# Altium project QuadCape_4Layer.PrjPcb
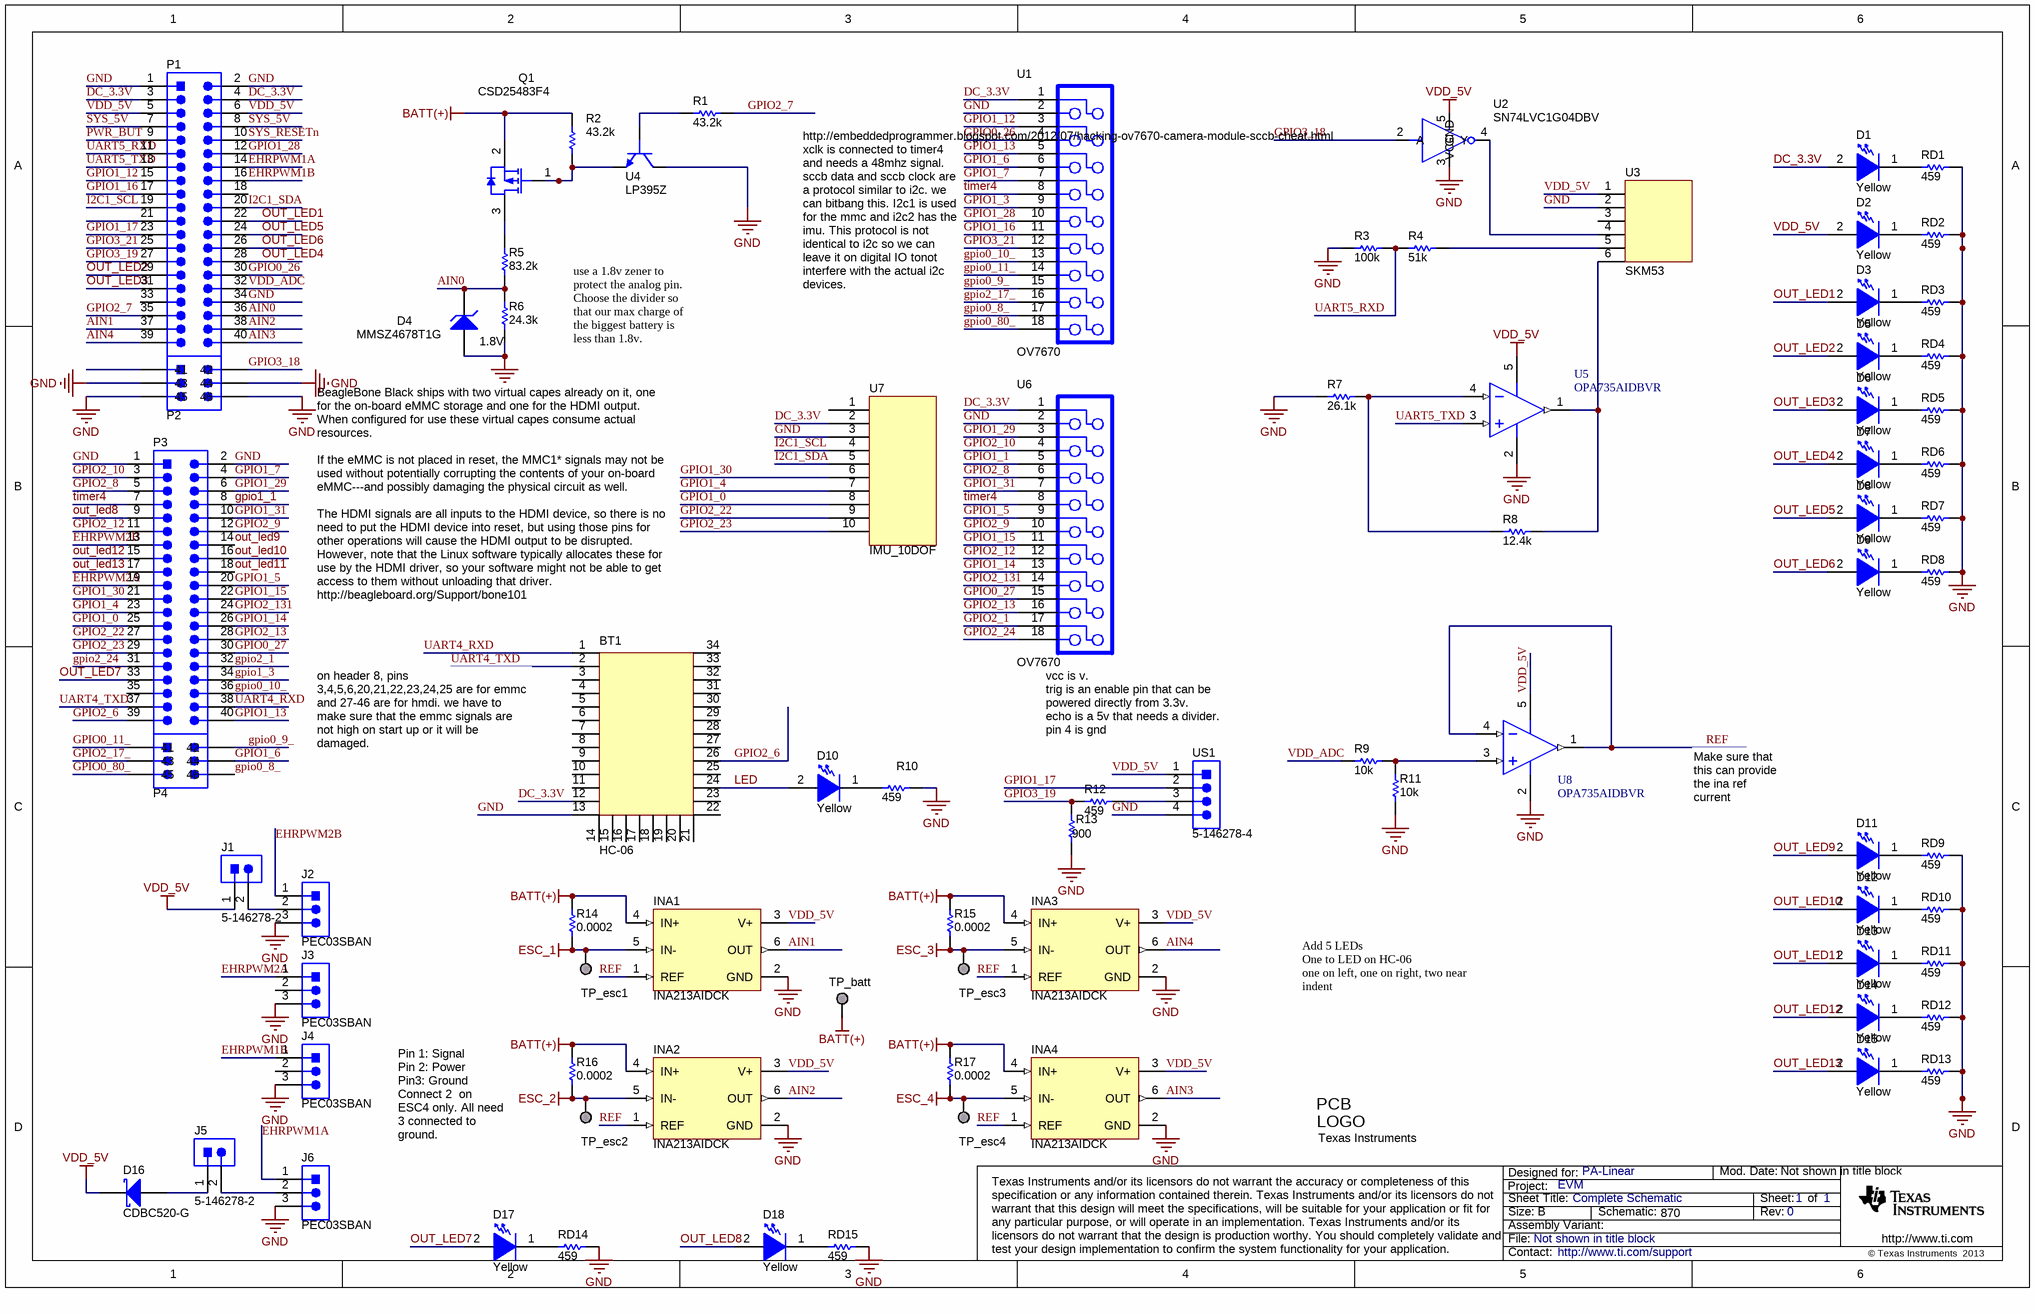
[diagram p0: QuadCape_4L_SCH.SchDoc]
CopyrightYear: 2013; PRJ_Customer: PA-Linear; PRJ_Title: EVM; SCH_Rev: 0; TechSupport: http://www.ti.com/support
1 sheet, 81 parts. Net scope: global (net labels, ports and power ports of the same name join across sheets).
Board file: QuadCape_4L_PCB.PcbDoc

## Sheet QuadCape_4L_SCH.SchDoc: Complete Schematic
size B; Date: Not shown in title block; ApprovedBy: Not shown in title block; CheckedBy: Not shown in title block; Author: Not shown in title block; CompanyName: Not shown in title block; DrawnBy: Not shown in title block; Engineer: Not shown in title block; Organization: Not shown in title block; Address1: Not shown in title block; Address2: Not shown in title block; Address3: Not shown in title block; Address4: Not shown in title block; DocumentNumber: 1; Revision: Use project parameter SCH_Rev; SheetNumber: 1; SheetTotal: 1; PageSetup: Record=PageOptions|CenterHorizontal=True|CenterVertical=True|PrintScale=0.72|XCorrection=1.00|YCorrection=1.00|PrintKind=0|BorderSize=5000000|LeftOffset=0|BottomOffset=0|Orientation=2|PaperLength=1000|PaperWidth=1000|Scale=100|PaperSource=15|PrintQuality=600|MediaType=1|DitherType=10|PaperKind=Letter|PrintScaleMode=1; CurrentTime: Not shown in title block; CurrentDate: Not shown in title block; Time: Not shown in title block; DocumentFullPathAndName: Not shown in title block; DocumentName: Not shown in title block; ModifiedDate: Not shown in title block; ImagePath: Not shown in title block

### Parts
BT1  HC-06  [HC-06]
D1  value Yellow  [WL-SMCW_YELLOW]  (hidden comment: 150060YS75000)
D2  value Yellow  [WL-SMCW_YELLOW]  (hidden comment: 150060YS75000)
D3  value Yellow  [WL-SMCW_YELLOW]  (hidden comment: 150060YS75000)
D4  MMSZ4678T1G  value 1.8V  [SOD-123]
D5  value Yellow  [WL-SMCW_YELLOW]  (hidden comment: 150060YS75000)
D6  value Yellow  [WL-SMCW_YELLOW]  (hidden comment: 150060YS75000)
D7  value Yellow  [WL-SMCW_YELLOW]  (hidden comment: 150060YS75000)
D8  value Yellow  [WL-SMCW_YELLOW]  (hidden comment: 150060YS75000)
D9  value Yellow  [WL-SMCW_YELLOW]  (hidden comment: 150060YS75000)
D10  value Yellow  [WL-SMCW_YELLOW]  (hidden comment: 150060YS75000)
D11  value Yellow  [WL-SMCW_YELLOW]  (hidden comment: 150060YS75000)
D12  value Yellow  [WL-SMCW_YELLOW]  (hidden comment: 150060YS75000)
D13  value Yellow  [WL-SMCW_YELLOW]  (hidden comment: 150060YS75000)
D14  value Yellow  [WL-SMCW_YELLOW]  (hidden comment: 150060YS75000)
D15  value Yellow  [WL-SMCW_YELLOW]  (hidden comment: 150060YS75000)
D16  CDBC520-G  [SMC]
D17  value Yellow  [WL-SMCW_YELLOW]  (hidden comment: 150060YS75000)
D18  value Yellow  [WL-SMCW_YELLOW]  (hidden comment: 150060YS75000)
INA1  INA213AIDCK  [DCK0006A_N]
INA2  INA213AIDCK  [DCK0006A_N]
INA3  INA213AIDCK  [DCK0006A_N]
INA4  INA213AIDCK  [DCK0006A_N]
J1  5-146278-2  [TE_5-146278-2]
J2  PEC03SBAN  [Sullins_PEC03SBAN]
J3  PEC03SBAN  [Sullins_PEC03SBAN]
J4  PEC03SBAN  [Sullins_PEC03SBAN]
J5  5-146278-2  [TE_5-146278-2]
J6  PEC03SBAN  [Sullins_PEC03SBAN]
Logo1  Texas Instruments  [TI_Symbol_Overlay_Small]  (no BOM)
P1  Comment  [TSW-120-07-G-D]  (value not drawn)
P2  Comment  [SULLINS_PEC03DAAN]  (value not drawn)
P3  Comment  [TSW-120-07-G-D]  (value not drawn)
P4  Comment  [SULLINS_PEC03DAAN]  (value not drawn)
Q1  CSD25483F4  [YJC0003A]
R1  value 43.2k  [0603]  (hidden comment: CRCW040243K2FKED)
R2  value 43.2k  [0603]  (hidden comment: CRCW040243K2FKED)
R3  value 100k  [0603]  (hidden comment: CRCW0402100KFKED)
R4  value 51k  [0603]  (hidden comment: CRCW040251K0JNED)
R5  value 83.2k  [0603]  (hidden comment: CRCW040243K2FKED)
R6  value 24.3k  [0603]  (hidden comment: CRCW040224K3FKED)
R7  value 26.1k  [0603]  (hidden comment: CRCW040226K1FKED)
R8  value 12.4k  [0603]  (hidden comment: CRCW040212K4FKED)
R9  value 10k  [0603]  (hidden comment: CRCW040210K0JNED)
R10  value 459  [0603]  (hidden comment: RT0603DRE07459RL)
R11  value 10k  [0603]  (hidden comment: CRCW040210K0JNED)
R12  value 459  [0603]  (hidden comment: RT0603DRE07459RL)
R13  value 900  [0603]  (hidden comment: RT0603DRE07459RL)
R14  value 0.0002  [2010M]  (hidden comment: CSNL2010FT1L00)
R15  value 0.0002  [2010M]  (hidden comment: CSNL2010FT1L00)
R16  value 0.0002  [2010M]  (hidden comment: CSNL2010FT1L00)
R17  value 0.0002  [2010M]  (hidden comment: CSNL2010FT1L00)
RD1  value 459  [0603]  (hidden comment: RT0603DRE07459RL)
RD2  value 459  [0603]  (hidden comment: RT0603DRE07459RL)
RD3  value 459  [0603]  (hidden comment: RT0603DRE07459RL)
RD4  value 459  [0603]  (hidden comment: RT0603DRE07459RL)
RD5  value 459  [0603]  (hidden comment: RT0603DRE07459RL)
RD6  value 459  [0603]  (hidden comment: RT0603DRE07459RL)
RD7  value 459  [0603]  (hidden comment: RT0603DRE07459RL)
RD8  value 459  [0603]  (hidden comment: RT0603DRE07459RL)
RD9  value 459  [0603]  (hidden comment: RT0603DRE07459RL)
RD10  value 459  [0603]  (hidden comment: RT0603DRE07459RL)
RD11  value 459  [0603]  (hidden comment: RT0603DRE07459RL)
RD12  value 459  [0603]  (hidden comment: RT0603DRE07459RL)
RD13  value 459  [0603]  (hidden comment: RT0603DRE07459RL)
RD14  value 459  [0603]  (hidden comment: RT0603DRE07459RL)
RD15  value 459  [0603]  (hidden comment: RT0603DRE07459RL)
TP_batt  TESTPOINT  [TESTPOINT]  (value not drawn)  (no BOM)
TP_esc1  TESTPOINT  [TESTPOINT]  (value not drawn)  (no BOM)
TP_esc2  TESTPOINT  [TESTPOINT]  (value not drawn)  (no BOM)
TP_esc3  TESTPOINT  [TESTPOINT]  (value not drawn)  (no BOM)
TP_esc4  TESTPOINT  [TESTPOINT]  (value not drawn)  (no BOM)
U1  OV7670  [HEADER_2X9]
U2  SN74LVC1G04DBV  [SOT23-5P]
U3  SKM53  [SKM53]
U4  LP395Z  [Z03A]
U5  OPA735AIDBVR  [DBV0005A_N]
U6  OV7670  [HEADER_2X9]
U7  IMU_10DOF  [IMU_10DOF]
U8  OPA735AIDBVR  [DBV0005A_N]
US1  5-146278-4  [TE_5-146278-4]

### Nets
BATT(+): INA1.4(IN+) INA2.4(IN+) INA3.4(IN+) INA4.4(IN+) Q1.2(S) R2.2 R14.1 R15.2 R16.1 R17.2 TP_batt.1
ESC_1: INA1.5(IN-) R14.2 TP_esc1.1
ESC_2: INA2.5(IN-) R16.2 TP_esc2.1
ESC_3: INA3.5(IN-) R15.1 TP_esc3.1
ESC_4: INA4.5(IN-) R17.1 TP_esc4.1
GND: BT1.13 D4.2(A) INA1.2(GND) INA2.2(GND) INA3.2(GND) INA4.2(GND) J2.3 J3.3 J4.3 J6.3 P1.1 P1.2 P1.34 P2.3(43) P2.4(44) P2.5(45) P2.6(46) P3.1 P3.2 R3.1 R6.1 R7.1 R10.2 R11.1 R13.1 RD1.2 RD2.2 RD3.2 RD4.2 RD5.2 RD6.2 RD7.2 RD8.2 RD9.2 RD10.2 RD11.2 RD12.2 RD13.2 RD14.2 RD15.2 U1.2 U2.3(GND) U3.2 U4.1(C) U5.2(V-) U6.2 U7.3 U8.2(V-) US1.4
VDD_5V: D2.2(A) D16.1(K) INA1.3(V+) INA2.3(V+) INA3.3(V+) INA4.3(V+) J1.1 P1.5 P1.6 U2.5(VCC) U3.1 U5.5(V+) U8.5(V+) US1.1
AIN0: D4.1(K) P1.36 R5.1 R6.2
AIN1: INA1.6(OUT) P1.37
AIN2: INA2.6(OUT) P1.38
AIN3: INA4.6(OUT) P1.40
AIN4: INA3.6(OUT) P1.39
DC_3.3V: BT1.12 D1.2(A) P1.3 P1.4 U1.1 U6.1 U7.2
EHRPWM1A: J6.1 P1.14
EHRPWM1B: J4.1 P1.16
EHRPWM2A: J3.1 P3.19
EHRPWM2B: J2.1 P3.13
gpio0_8_: P4.6(46) U1.17
gpio0_9_: P4.2(42) U1.15
gpio0_10_: P3.36 U1.13
GPIO0_11_: P4.1(41) U1.14
GPIO0_26: P1.30 U1.4
GPIO0_27: P3.30 U6.15
GPIO0_80_: P4.5(45) U1.18
GPIO1_0: P3.25 U7.8
GPIO1_1: P3.8 U6.5
GPIO1_3: P3.34 U1.9
GPIO1_4: P3.23 U7.7
GPIO1_5: P3.20 U6.9
GPIO1_6: P4.4(44) U1.6
GPIO1_7: P3.4 U1.7
GPIO1_12: P1.15 U1.3
GPIO1_13: P3.40 U1.5
GPIO1_14: P3.26 U6.13
GPIO1_15: P3.22 U6.11
GPIO1_16: P1.17 U1.11
GPIO1_17: P1.23 US1.2
GPIO1_28: P1.12 U1.10
GPIO1_29: P3.6 U6.3
GPIO1_30: P3.21 U7.6
GPIO1_31: P3.10 U6.7
GPIO2_1: P3.32 U6.17
GPIO2_6: BT1.26 P3.39
GPIO2_7: P1.35 R1.1
GPIO2_8: P3.5 U6.6
GPIO2_9: P3.12 U6.10
GPIO2_10: P3.3 U6.4
GPIO2_12: P3.11 U6.12
GPIO2_13: P3.28 U6.16
GPIO2_17_: P4.3(43) U1.16
GPIO2_22: P3.27 U7.9
GPIO2_23: P3.29 U7.10
GPIO2_24: P3.31 U6.18
GPIO2_131: P3.24 U6.14
GPIO3_18: P2.2(42) U2.2(A)
GPIO3_19: P1.27 R12.1 R13.2
GPIO3_21: P1.25 U1.12
I2C1_SCL: P1.19 U7.4
I2C1_SDA: P1.20 U7.5
LED: BT1.24 D10.2(A)
OUT_LED1: D3.2(A) P1.22
OUT_LED2: D5.2(A) P1.29
OUT_LED3: D6.2(A) P1.31
OUT_LED4: D7.2(A) P1.28
OUT_LED5: D8.2(A) P1.24
OUT_LED6: D9.2(A) P1.26
OUT_LED7: D17.2(A) P3.33
OUT_LED8: D18.2(A) P3.9
OUT_LED9: D11.2(A) P3.14
OUT_LED10: D12.2(A) P3.16
OUT_LED11: D13.2(A) P3.18
OUT_LED12: D14.2(A) P3.15
OUT_LED13: D15.2(A) P3.17
PWR_BUT: P1.9
REF: INA1.1(REF) INA2.1(REF) INA3.1(REF) INA4.1(REF) U8.1(OUT) U8.4(IN-)
SYS_5V: P1.7 P1.8
SYS_RESETn: P1.10
timer4: P3.7 U1.8 U6.8
UART4_RXD: BT1.1 P3.38
UART4_TXD: BT1.2 P3.37
UART5_RXD: P1.11 R3.2 R4.2
UART5_TXD: P1.13 U5.3(IN+)
VDD_ADC: P1.32 R9.1
NetD1_1: D1.1(K) RD1.1
NetD2_1: D2.1(K) RD2.1
NetD3_1: D3.1(K) RD3.1
NetD5_1: D5.1(K) RD4.1
NetD6_1: D6.1(K) RD5.1
NetD7_1: D7.1(K) RD6.1
NetD8_1: D8.1(K) RD7.1
NetD9_1: D9.1(K) RD8.1
NetD10_1: D10.1(K) R10.1
NetD11_1: D11.1(K) RD9.1
NetD12_1: D12.1(K) RD10.1
NetD13_1: D13.1(K) RD11.1
NetD14_1: D14.1(K) RD12.1
NetD15_1: D15.1(K) RD13.1
NetD16_2: D16.2(A) J5.1
NetD17_1: D17.1(K) RD14.1
NetD18_1: D18.1(K) RD15.1
NetJ1_2: J1.2 J2.2
NetJ5_2: J5.2 J6.2
NetQ1_1: Q1.1(G) R2.1 U4.3(E)
NetQ1_3: Q1.3(D) R5.2
NetR1_2: R1.2 U4.2(B)
NetR4_1: R4.1 U3.5
NetR7_2: R7.2 R8.1 U5.4(IN-)
NetR8_2: R8.2 U3.6 U5.1(OUT)
NetR9_2: R9.2 R11.2 U8.3(IN+)
NetR12_2: R12.2 US1.3
NetU2_4: U2.4(Y) U3.4

Not connected (* = marked no-connect by the designer): BT1 3 4 5 6 7 8 9 10 11 14 15 16 17 18 19 20 21 22 23 25 27 28 29 30 31 32 33 34; J3 2; J4 2; P1 18 21 33; P2 1(41); P3 35; U3 3; U7 1

### Notes on the sheet
- use a 1.8v zener to protect the analog pin. Choose the divider so that our max charge of the biggest battery is less than 1.8v.
- http://embeddedprogrammer.blogspot.com/2012/07/hacking-ov7670-camera-module-sccb-cheat.html
  xclk is connected to timer4 and needs a 48mhz signal. sccb data and sccb clock are a protocol similar to i2c. we can bitbang this. I2c1 is used for the mmc and i2c2 has the imu. This protocol is not identical to i2c so we can leave it on digital IO tonot interfere with the actual i2c devices.
- BeagleBone Black ships with two virtual capes already on it, one for the on-board eMMC storage and one for the HDMI output. When configured for use these virtual capes consume actual resources.
  If the eMMC is not placed in reset, the MMC1* signals may not be used without potentially corrupting the contents of your on-board eMMC---and possibly damaging the physical circuit as well.
  The HDMI signals are all inputs to the HDMI device, so there is no need to put the HDMI device into reset, but using those pins for other operations will cause the HDMI output to be disrupted. However, note that the Linux software typically allocates these for use by the HDMI driver, so your software might not be able to get access to them without unloading that driver.
  http://beagleboard.org/Support/bone101
- on header 8, pins 3,4,5,6,20,21,22,23,24,25 are for emmc and 27-46 are for hmdi. we have to make sure that the emmc signals are not high on start up or it will be damaged.
- vcc is v.
  trig is an enable pin that can be powered directly from 3.3v.
  echo is a 5v that needs a divider.
  pin 4 is gnd
- Make sure that this can provide the ina ref current
- Add 5 LEDs
  One to LED on HC-06
  one on left, one on right, two near indent
- Pin 1: Signal
  Pin 2: Power
  Pin3: Ground
  Connect 2  on ESC4 only. All need 3 connected to ground.
- Project:
- Designed for:
- Mod. Date:
- Sheet Title:
- Size:
- File:
- Assembly Variant:
- B
- Schematic:
- 870
- Rev:
- Sheet:
- of
- http://www.ti.com
- Texas Instruments and/or its licensors do not warrant the accuracy or completeness of this specification or any information contained therein. Texas Instruments and/or its licensors do not warrant that this design will meet the specifications, will be suitable for your application or fit for any particular purpose, or will operate in an implementation. Texas Instruments and/or its licensors do not warrant that the design is production worthy. You should completely validate and test your design implementation to confirm the system functionality for your application.
- Contact:
- © Texas Instruments
- (in symbol TI_Logo) PCB; LOGO

### Library data of the parts
BT1 = HC-06: Manufacturer: Used in BOM report; SymbolVersion: use current date i.e. 2008-05-20; SymbolCreator: Use a-id; CompType: Used in some BOM reports.  Useful for finding later.; U/M: EA, IN, or GM; MountType: SMT, TH, or N/A; RoHS: Used in BOM report.  Use Y or N.; PartNumber: Used in BOM report; PackageReference: eg:  0603, used in PnP report; ComponentLink1Description: Datasheet Link; Alternate PartNumber: -; Alternate Manufacturer: -
D1-D3 D5-D15 D17 D18 = 150060YS75000: LED, Yellow, SMD; Manufacturer: Wurth Elektronik eiSos; Type: AlInGaP; Vf_V: 2; Value2: 2V; Io_A: 0.02; Value1: W; U/M: EA; CompType: LED; PartNumber: 150060YS75000; SymbolVersion: 2008-11-06; MountType: SMT; RoHS: Y; PackageReference: LED_0603; Color: yellow; Published: 2008-07-11; Publisher: Texas Instruments; ComponentLink1URL: http://katalog.we-online.de/led/datasheet/150060YS75000.pdf; ComponentLink1Description: Datasheet link; LatestRevisionDate: 2014-06-18; Supplier 1: Digi-Key; Supplier Part Number 1: 732-4981-1-ND
D4 = MMSZ4678T1G: Diode, Zener, 1.8V, 500mW, SOD-123; Manufacturer: ON Semiconductor; SymbolCreator: a0412235; U/M: EA; Power_W: 0.5; Vz_V: 1.8; Value1: 0.5W; RJA_CperW: 340; SymbolVersion: 2010-08-25; PartNumber: MMSZ4678T1G; PackageReference: SOD-123; CompType: Zener; Vr_V: N/A; MountType: SMT; RoHS: Y; ComponentLink1Description: Datasheet link; ComponentLink1URL: http://www.onsemi.com/pub_link/Collateral/MMSZ4678T1-D.PDF; Published: 2008-10-08; Publisher: Texas Instruments; LatestRevisionDate: 2014-06-11; LatestRevisionNote: Updated Supplier Data; Supplier 1: Digi-Key; Supplier Part Number 1: MMSZ4678T1GOSCT-ND; Supplier 2: Mouser; Supplier Part Number 2: 863-MMSZ4678T1G; Supplier 3: Farnell; Supplier Part Number 3: 1459115
D16 = CDBC520-G: Diode, Schottky, 20V, 5A, SMC; Manufacturer: Comchip Technology; U/M: EA; Vf_V: 0.55; Value2: 0.55V; Io_A: 5; Vr_V: 20; TJmax_C: 125; CompType: Diode; SymbolVersion: 2008-12-08; PartNumber: CDBC520-G; PackageReference: SMC; Value: 20V; Value1: 5A; MountType: SMT; Type: Schottky; RoHS: Y; Published: 2008-06-26; Publisher: Texas Instruments; LatestRevisionDate: 2014-06-24; ComponentLink1Description: Datasheet link; ComponentLink1URL: http://www.comchip.com.tw/cms/UserFiles/QW-BB012%20CDBC520-G%7E5100-G%20RevC809622.pdf; Supplier 1: Digi-Key; Supplier Part Number 1: 641-1125-1-ND; Supplier 2: Mouser; Supplier Part Number 2: 750-CDBC520-G
INA1-INA4 = INA213AIDCK: Voltage Output, High or Low Side Measurement, Bi-Directional Zero-Drift Series Current-Shunt Monitor, DCK0006A; Alternate Manufacturer: None; Manufacturer: Texas Instruments; SymbolCreator: a0411947; CompType: IC; U/M: EA; SymbolVersion: 2013-07-03; PartNumber: INA213AIDCK; PackageReference: DCK0006A; MountType: SMT; ComponentLink1Description: Datasheet Link; ComponentLink1URL: http://www.ti.com/lit/ds/symlink/ina211.pdf; RoHS: Y; Publisher: Texas Instruments; LatestRevisionDate: 2014-06-17
J1 J5 = 5-146278-2: Header, 100mil, 2x1, Tin, TH; Manufacturer: TE Connectivity; SymbolCreator: a0412235; U/M: EA; SymbolVersion: 2013-10-31; PartNumber: 5-146278-2; ClassName: Header; PackageReference: Header, 2x1, 100mil, TH; CompType: Header; RoHS: Y; MountType: TH; ComponentLink1Description: Datasheet Link; ComponentLink1URL: http://www.te.com/commerce/DocumentDelivery/DDEController?Action=srchrtrv&DocNm=146278&DocType=Customer+Drawing&DocLang=English; Publisher: Texas Instruments; LatestRevisionDate: 2014-06-17; Supplier 1: Digi-Key; Supplier Part Number 1: 5-146278-2-ND; Supplier 2: Mouser; Supplier Part Number 2: 571-5-146278-2
J2-J4 J6 = PEC03SBAN: Header, 100mil, 3x1, Tin, R/A, TH; Manufacturer: Sullins Connector Solutions; SymbolCreator: a0799628; U/M: EA; SymbolVersion: 2013-03-28; PartNumber: PEC03SBAN; ClassName: Header; PackageReference: Header, 3x1, RA; CompType: Header; RoHS: Y; MountType: TH; ComponentLink1Description: Datasheet Link; ComponentLink1URL: http://www.sullinscorp.com/catalogs/97_Page78-79_HEADER_.100_2.54mm_MALE_BREAKAWAY.pdf; Publisher: Texas Instruments; LatestRevisionDate: 2014-06-17; Supplier 1: Digi-Key; Supplier Part Number 1: S1112E-03-ND
Logo1 = TI_Logo: Texas Instrument Corporate Signature; SymbolCreator: codlsc; SymbolVersion: 2011-08-22; ClassName: Logo; Published: 2009-03-03; Publisher: Texas Instruments; LatestRevisionDate: 2012-05-17; LatestRevisionNote: Changed publisher
P1 P3 = TSW-120-07-G-D: Header, 100mil, 20x2, Gold, TH; Manufacturer: Samtec; SymbolCreator: a0412235; U/M: EA; SymbolVersion: 2013-10-14; PartNumber: TSW-120-07-G-D; ClassName: Header; PackageReference: 20x2 Header; CompType: Header; RoHS: Y; MountType: TH; ComponentLink1Description: Datasheet Link; ComponentLink1URL: http://samtec.com/ftppub/pdf/TSW_TH.PDF; Publisher: Texas Instruments; LatestRevisionDate: 2014-06-17; Supplier 1: Digi-Key; Supplier Part Number 1: SAM1028-20-ND
P2 P4 = PEC03DAAN: Header, 100mil, 3x2, Tin, TH; Manufacturer: Sullins Connector Solutions; SymbolCreator: a0412235; U/M: EA; SymbolVersion: 2013-10-14; PartNumber: PEC03DAAN; ClassName: Header; PackageReference: 3x2 Header; CompType: Header; RoHS: Y; MountType: TH; ComponentLink1Description: Datasheet Link; ComponentLink1URL: http://www.sullinscorp.com/catalogs/97_Page78-79_HEADER_.100_2.54mm_MALE_BREAKAWAY.pdf; Publisher: Texas Instruments; LatestRevisionDate: 2014-06-17; Supplier 1: Digi-Key; Supplier Part Number 1: S2012E-03-ND
Q1 = CSD25483F4: MOSFET, P-CH, -20V, -1.6A, 1.0x0.35x0.6mm; Manufacturer: Texas Instruments; Alternate Manufacturer: None; U/M: EA; ChType: P; VdsMax_V: -20; Value1: 0.21 ohm; Rdson45_Ohm: 0.21; Value2: 0.959 nC; QgTyp_nC: 0.959; Vgs_V: -12; IdsMax_A: -1.6; SymbolVersion: 2008-07-09; PartNumber: CSD25483F4; PackageReference: 1.0x0.35x0.6mm; CompType: MOSFET; Value: -20V; RoHS: Y; MountType: SMT; Published: 2008-06-19; Publisher: Texas Instruments; LatestRevisionDate: 2014-06-19; LatestRevisionNote: Added parts.; ComponentLink1Description: Datasheet link; ComponentLink1URL: http://www.ti.com/lit/ds/symlink/csd25483f4.pdf; Supplier 1: Digi-Key; Supplier Part Number 1: CSD25483F4-ND; Supplier 2: Mouser; Supplier Part Number 2: 595-CSD25483F4
R1 R2 R5 = CRCW040243K2FKED: RES, 43.2k ohm, 1%, 0.063W, 0402; Manufacturer: Vishay-Dale; CompType: Resistor; Res_ohm: 43200; Value_Code: 43k2; Tolerance_%: 1; Power_W: 0.063; VDC_V: 50; TempCo: 100 ppm/C; EIA_Code: E96; U/M: EA; SymbolVersion: 2009-05-29; PartNumber: CRCW040243K2FKED; PackageReference: 0402; RoHS: Y; Value1: 1%; Value2: 0.063W; MountType: SMT; Technology: Thick Film; Published: 2008-06-26; Publisher: Texas Instruments; LatestRevisionDate: 2014-06-26; ComponentLink1Description: Datasheet link; ComponentLink1URL: http://www.vishay.com/docs/20035/dcrcwe3.pdf; Supplier 1: Digi-Key; Supplier Part Number 1: 541-43.2KLCT-ND; Supplier 2: Mouser; Supplier Part Number 2: 71-CRCW0402-43.2K-E3; Supplier 3: Farnell; Supplier Part Number 3: 1469717
R3 = CRCW0402100KFKED: RES, 100k ohm, 1%, 0.063W, 0402; Manufacturer: Vishay-Dale; CompType: Resistor; Res_ohm: 100000; Tolerance_%: 1; Power_W: 0.063; VDC_V: 50; TempCo: 100 ppm/C; EIA_Code: E96; U/M: EA; SymbolVersion: 2009-05-29; PartNumber: CRCW0402100KFKED; PackageReference: 0402; RoHS: Y; Value_Code: 100k; Value1: 1%; Value2: 0.063W; MountType: SMT; Technology: Thick Film; Published: 2008-06-26; Publisher: Texas Instruments; LatestRevisionDate: 2014-06-26; ComponentLink1Description: Datasheet link; ComponentLink1URL: http://www.vishay.com/docs/20035/dcrcwe3.pdf; Supplier 1: Digi-Key; Supplier Part Number 1: 541-100KLCT-ND; Supplier 2: Mouser; Supplier Part Number 2: 71-CRCW0402-100K-E3; Supplier 3: Farnell; Supplier Part Number 3: 1469671
R4 = CRCW040251K0JNED: RES, 51k ohm, 5%, 0.063W, 0402; Manufacturer: Vishay-Dale; CompType: Resistor; Res_ohm: 51000; Value_Code: 51k0; Tolerance_%: 5; Power_W: 0.063; VDC_V: 50; TempCo: 200 ppm/C; EIA_Code: E24; U/M: EA; SymbolVersion: 2009-05-29; PartNumber: CRCW040251K0JNED; PackageReference: 0402; RoHS: Y; Value1: 5%; Value2: 0.063W; MountType: SMT; Technology: Thick Film; Published: 2008-06-26; Publisher: Texas Instruments; LatestRevisionDate: 2014-06-26; ComponentLink1Description: Datasheet link; ComponentLink1URL: http://www.vishay.com/docs/20035/dcrcwe3.pdf; Supplier 1: Digi-Key; Supplier Part Number 1: 541-51KJCT-ND; Supplier 2: Farnell; Supplier Part Number 2: 1570680; Supplier 3: Newark; Supplier Part Number 3: 89M6676
R6 = CRCW040224K3FKED: RES, 24.3k ohm, 1%, 0.063W, 0402; Manufacturer: Vishay-Dale; CompType: Resistor; Res_ohm: 24300; Value_Code: 24k3; Tolerance_%: 1; Power_W: 0.063; VDC_V: 50; TempCo: 100 ppm/C; EIA_Code: E96; U/M: EA; SymbolVersion: 2009-05-29; PartNumber: CRCW040224K3FKED; PackageReference: 0402; RoHS: Y; Value1: 1%; Value2: 0.063W; MountType: SMT; Technology: Thick Film; Published: 2008-06-26; Publisher: Texas Instruments; LatestRevisionDate: 2014-06-26; ComponentLink1Description: Datasheet link; ComponentLink1URL: http://www.vishay.com/docs/20035/dcrcwe3.pdf; Supplier 1: Digi-Key; Supplier Part Number 1: 541-24.3KLCT-ND; Supplier 2: Mouser; Supplier Part Number 2: 71-CRCW0402-24.3K-E3; Supplier 3: Farnell; Supplier Part Number 3: 1151056
R7 = CRCW040226K1FKED: RES, 26.1k ohm, 1%, 0.063W, 0402; Manufacturer: Vishay-Dale; CompType: Resistor; Res_ohm: 26100; Value_Code: 26k1; Tolerance_%: 1; Power_W: 0.063; VDC_V: 50; TempCo: 100 ppm/C; EIA_Code: E96; U/M: EA; SymbolVersion: 2009-05-29; PartNumber: CRCW040226K1FKED; PackageReference: 0402; RoHS: Y; Value1: 1%; Value2: 0.063W; MountType: SMT; Technology: Thick Film; Published: 2008-06-26; Publisher: Texas Instruments; LatestRevisionDate: 2014-06-26; ComponentLink1Description: Datasheet link; ComponentLink1URL: http://www.vishay.com/docs/20035/dcrcwe3.pdf; Supplier 1: Digi-Key; Supplier Part Number 1: 541-26.1KLCT-ND; Supplier 2: Mouser; Supplier Part Number 2: 71-CRCW0402-26.1K-E3; Supplier 3: Farnell; Supplier Part Number 3: 1151080
R8 = CRCW040212K4FKED: RES, 12.4k ohm, 1%, 0.063W, 0402; Manufacturer: Vishay-Dale; CompType: Resistor; Res_ohm: 12400; Value_Code: 12k4; Tolerance_%: 1; Power_W: 0.063; VDC_V: 50; TempCo: 100 ppm/C; EIA_Code: E96; U/M: EA; SymbolVersion: 2009-05-29; PartNumber: CRCW040212K4FKED; PackageReference: 0402; RoHS: Y; Value1: 1%; Value2: 0.063W; MountType: SMT; Technology: Thick Film; Published: 2008-06-26; Publisher: Texas Instruments; LatestRevisionDate: 2014-06-26; ComponentLink1Description: Datasheet link; ComponentLink1URL: http://www.vishay.com/docs/20035/dcrcwe3.pdf; Supplier 1: Digi-Key; Supplier Part Number 1: 541-12.4KLCT-ND; Supplier 2: Mouser; Supplier Part Number 2: 71-CRCW0402-12.4K-E3; Supplier 3: Farnell; Supplier Part Number 3: 1652748
R9 R11 = CRCW040210K0JNED: RES, 10k ohm, 5%, 0.063W, 0402; Manufacturer: Vishay-Dale; CompType: Resistor; Res_ohm: 10000; Value_Code: 10k0; Tolerance_%: 5; Power_W: 0.063; VDC_V: 50; TempCo: 200 ppm/C; EIA_Code: E24; U/M: EA; SymbolVersion: 2009-05-29; PartNumber: CRCW040210K0JNED; PackageReference: 0402; RoHS: Y; Value1: 5%; Value2: 0.063W; MountType: SMT; Technology: Thick Film; Published: 2008-06-26; Publisher: Texas Instruments; LatestRevisionDate: 2014-06-26; ComponentLink1Description: Datasheet link; ComponentLink1URL: http://www.vishay.com/docs/20035/dcrcwe3.pdf; Supplier 1: Mouser; Supplier Part Number 1: 71-CRCW0402J-10K-E3; Supplier 2: Farnell; Supplier Part Number 2: 1514663; Supplier 3: Newark; Supplier Part Number 3: 59M6696
R10 R12 R13 RD1-RD15 = RT0603DRE07459RL: RES, 459 ohm, 0.5%, 0.1W, 0603; Manufacturer: Yageo America; CompType: Resistor; Value_Code: 459R; Tolerance_%: 0.5; Power_W: 0.1; VDC_V: 75; TempCo: 50 ppm/C; EIA_Code: E192; U/M: EA; SymbolVersion: 2009-05-29; PartNumber: RT0603DRE07459RL; PackageReference: 0603; RoHS: Y; Value1: 0.5%; Value2: 0.1W; MountType: SMT; Technology: Thin Film; Published: 2008-06-26; Publisher: Texas Instruments; LatestRevisionDate: 2014-05-20; ComponentLink1Description: Datasheet link; ComponentLink1URL: http://www.yageo.com/pdf/PYu-RT_1-to-0.05_RoHS_L_3.pdf
  R10 R12 RD1-RD15: Res_ohm: 459
  R13: Res_ohm: 900
R14-R17 = CSNL2010FT1L00: RES, 0.001 ohm, 1%, 1.5W, 2010; Manufacturer: Stackpole Electronics Inc; CompType: Resistor; Res_ohm: 0.001; Value_Code: R001; Tolerance_%: 1; Power_W: 1.5; TempCo: 50 ppm/C; EIA_Code: E96; U/M: EA; SymbolVersion: 2009-05-29; PartNumber: CSNL2010FT1L00; PackageReference: 2010; RoHS: Y; Value1: 1%; Value2: 1.5W; MountType: SMT; Technology: Metal Film; Published: 2008-06-26; Publisher: Texas Instruments; LatestRevisionDate: 2014-06-05; ComponentLink1Description: Datasheet link; ComponentLink1URL: http://www.seielect.com/Catalog/SEI-CSNL.pdf; Supplier 1: Digi-Key; Supplier Part Number 1: CSNL2010FT1L00CT-ND
TP_batt TP_esc1-TP_esc4 = TESTPOINT: TEST POINT.  No entry in BOM.; SymbolVersion: 2010-10-20; CompType: Testpoint; Publisher: Texas Instruments; LatestRevisionDate: 2014-06-06; LatestRevisionNote: Added Alternate PartNumber and Alternate Manufacturer parameters to appropriate components.
U1 U6 = HEADER_2X9: Header, Male 2x9 pin, 100mil spacing; Manufacturer: Sullins; PartNumber: PEC09DAAN; area: 213900; Value: PEC09DAAN; ComponentLink1URL: \\vette02\pmp_pcb\pcad_pdf's\PEC36DAAN.pdf; ComponentHeight: 0.330 inch; SymbolVersion: 05/14/2009 13:36:29; PackageReference: 0.100 x 2 X 9 inch; ComponentLink1Description: AEO Datasheet Link
U2 = SN74LVC1G04DBV: IC, Single Inverter; Manufacturer: TI; Alternate Manufacturer: None; Area: 23.200; ComponentLink1URL: \\vette02\pmp_pcb\pcad_pdf's\74lvc1g04.pdf; SymbolVersion: 05/13/2011 08:44:46; PackageReference: SOT23-5; PartNumber: SN74LVC1G04DBV; Value: SN74LVC1G04DBV; ComponentLink1Description: AEO Datasheet Link
U3 = SKM53: Manufacturer: Used in BOM report; SymbolVersion: use current date i.e. 2008-05-20; SymbolCreator: Use a-id; CompType: Used in some BOM reports.  Useful for finding later.; U/M: EA, IN, or GM; MountType: SMT, TH, or N/A; RoHS: Used in BOM report.  Use Y or N.; PartNumber: Used in BOM report; PackageReference: eg:  0603, used in PnP report; ComponentLink1Description: Datasheet Link; Alternate PartNumber: -; Alternate Manufacturer: -
U4 = LP395Z: Ultra Reliable Power Transistor, 3-pin TO-92; Manufacturer: Texas Instruments; PackageTopMarking: NSXYTT*LP*395Z; PowerWise: N; CompType: MiscPower; Published: 4-Dec-2008; DatasheetVersion: Apr-2005; PackageVersion: revG, Sep-2000; PackageReference: Z03A; Publisher: Altium Limited; PackageDescription: TO-92, Molded, 3 Lead; Supplier 1: Farnell; Supplier Part Number 1: 9488286; PartNumber: LP395Z; RoHS: N; PinCount: 3; Code_JEDEC: TO-226-AA; ComponentLink1Description: LP395 Datasheet; ComponentLink1URL: http://www.national.com/ds/LP/LP395.pdf; ComponentLink2Description: LP395 Web Page; ComponentLink2URL: http://www.national.com/pf/LP/LP395.html; ComponentLink3Description: Z03A Package Page; ComponentLink3URL: http://www.national.com/packaging/folders/z03a.html
U5 U8 = OPA735AIDBVR: 0.05 uV/degC (Max), Single-Supply CMOS Zero-Drift Series Operational Amplifier, 2.7 to 12 V, -40 to 85 degC, 5-pin SOT23 (DBV0005A), Green (RoHS & no Sb/Br); Manufacturer: Texas Instruments; Alternate Manufacturer: None; Alternate PartNumber: Equivalent; CMRR(Min)(dB): 115; GBW(Typ)(MHz): 1.6; IIB(Max)(pA): 200; Iq per channel(Max)(mA): 0.75; Number of Channels: 1; Offset Drift(Typ)(uV/C): 0.01; Packing: LARGE T&R; Rating: Catalog; Slew Rate(Typ)(V/us): 1.5; Sub Family: Low Offset Voltage Amplifier (<=500uV), Low Supply Voltage Amplifier (<=2.7V), Precision Amplifier, Zero Drift Precision Amplifier; Total Supply Voltage(Max)(+5V is 5, +/-5V is 10): 12; Total Supply Voltage(Min)(+5V is 5, +/-5V is 10): 2.7; Vio (25C)(Max)(mV): 0.005; DatasheetVersion: SBOS282B; PackageVersion: 4073253-4/K, 03/2006; PackageReference: DBV0005A; PackageDescription: 5-Pin Plastic Small Outline, Body 1.6 x 2.9 mm, Pitch 0.95 mm; Supplier 1: Digi-Key; Supplier Part Number 1: OPA735AIDBVR-ND; Supplier 2: Newark; Supplier Part Number 2: 90H2264; Supplier 3: Mouser; Supplier Part Number 3: 595-OPA735AIDBVR; Eco-Plan: Green (RoHS & no Sb/Br); MountType: SMT; Code_JEDEC: MO-178; ComponentLink1Description: Manufacturer URL; ComponentLink1URL: http://www.ti.com/; ComponentLink2Description: Datasheet; ComponentLink2URL: http://www.ti.com/lit/ds/symlink/opa735.pdf; ComponentLink3Description: Package Specification; ComponentLink3URL: http://www.ti.com/litv/pdf/mpds018i; PartNumber: OPA735AIDBVR
US1 = 5-146278-4: Header, 100mil, 4x1, Tin, TH; Manufacturer: TE Connectivity; SymbolCreator: a0412235; U/M: EA; SymbolVersion: 2013-08-30; PartNumber: 5-146278-4; ClassName: Header; PackageReference: Header, 4x1, 100mil, TH; CompType: Header; RoHS: Y; MountType: TH; ComponentLink1Description: Datasheet Link; ComponentLink1URL: http://www.te.com/commerce/DocumentDelivery/DDEController?Action=srchrtrv&DocNm=146278&DocType=Customer+Drawing&DocLang=English; Publisher: Texas Instruments; LatestRevisionDate: 2014-06-26; Supplier 1: Digi-Key; Supplier Part Number 1: 5-146278-4-ND; Supplier 2: Mouser; Supplier Part Number 2: 571-5-146278-4

## Assembly variants
-100A: all parts fitted